# EAGLE schematic motor_comp (EAGLE 8.4.3)
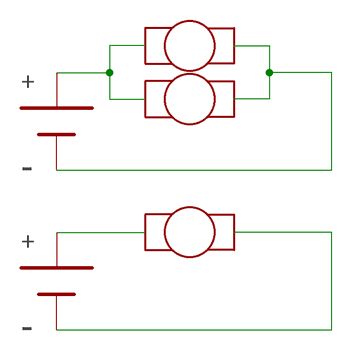
[diagram p0: schematic, sheet 1]

## Parts
U$1  MABUCHI-FC280SA  [DC_MOTOR]
U$2  MABUCHI-FC280SA  [DC_MOTOR]
U$3  BATTERY  [DC_MOTOR]
U$5  MABUCHI-FC280SA  [DC_MOTOR]
U$6  BATTERY  [DC_MOTOR]

## Nets
N$1: U$1.P$1 U$2.P$1 U$3.P$1
N$2: U$1.P$2 U$2.P$2 U$3.P$2
N$3: U$5.P$1 U$6.P$1
N$4: U$5.P$2 U$6.P$2

## Library data of the parts
U$1 U$2 U$5 = Motor:MABUCHI-FC280SA
U$3 U$6 = Motor:BATTERY